# Altium schematic sheet HX6320.SchDoc.schdoc
size A3
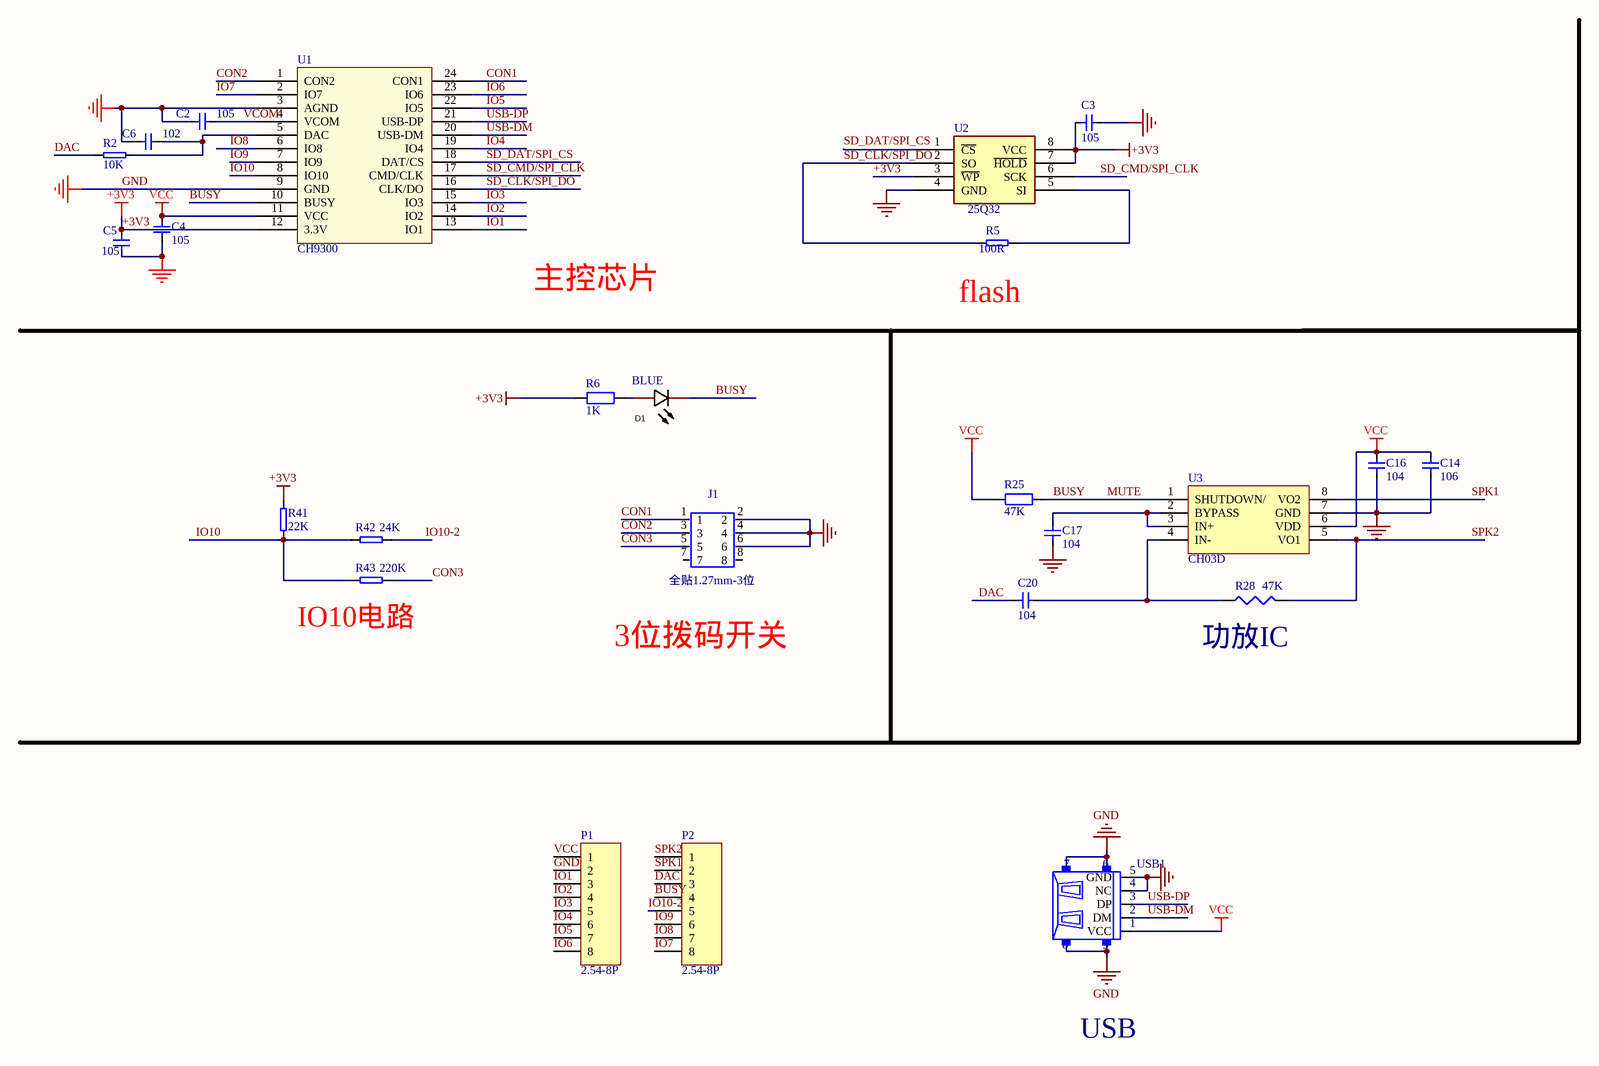
[diagram p0: HX6320.SchDoc.schdoc]

## Parts
C2  105  [C0603]
C3  105  [C0603]
C4  105  [C0603]
C5  105  [C0603]
C6  102  [C0603]
C14  106  [C0603]
C16  104  [C0603]
C17  104  [C0603]
C20  104  [C0603]
D1  BLUE  [LC-0603_LED_S1]
J1  全贴1.27mm-3位  [SW-SMD_DSHP02TSGER]
P1  2.54-8P  [HDR1X8]
P2  2.54-8P  [HDR1X8]
R2  10K  [R0603]
R5  100R  [R0603]
R6  1K  [R0603]
R25  47K  [R0603]
R28  47K  [R0603]
R41  22K  [R0603]
R42  24K  [R0603]
R43  220K  [R0603]
U1  CH9300  [QSOP24]
U2  25Q32  [LC-SOIC-8_150-208mil]
U3  CH03D  [LC-SOP-8_150mil]
USB1  USB-5PIN  [USB-MIRO]  (value not drawn)

## Nets
+3V3: C3.1 C5.1 R6.1 R41.2 U1.12(3.3V) U2.3(~{WP}) U2.7(~{HOLD}) U2.8(VCC)
GND: C2.2 C3.2 C4.1 C5.2 C6.2 C14.1 C16.1 C17.1 J1.2 J1.4 J1.6 P1.2 U1.3(AGND) U1.9(GND) U2.4(GND) U3.7(GND) USB1.4(NC) USB1.5(GND) USB1.6 USB1.7 USB1.8 USB1.9
VCC: C4.2 C14.2 C16.2 P1.1 R25.2 U1.11(VCC) U3.6(VDD) USB1.1(VCC)
BUSY: D1.1(K) P2.4 R25.1 U1.10(BUSY) U3.1(SHUTDOWN/)  [also labelled MUTE]
CON1: J1.1 U1.24(CON1)
CON2: J1.3 U1.1(CON2)
CON3: J1.5 R43.1
DAC: C20.1 P2.3 R2.2
IO1: P1.3 U1.13(IO1)
IO2: P1.4 U1.14(IO2)
IO3: P1.5 U1.15(IO3)
IO4: P1.6 U1.19(IO4)
IO5: P1.7 U1.22(IO5)
IO6: P1.8 U1.23(IO6)
IO7: P2.8 U1.2(IO7)
IO8: P2.7 U1.6(IO8)
IO9: P2.6 U1.7(IO9)
IO10: R41.1 R42.2 R43.2 U1.8(IO10)
IO10-2: P2.5 R42.1
SD_CLK/SPI_DO: R5.2 U1.16(CLK/DO) U2.2(SO)
SD_CMD/SPI_CLK: U1.17(CMD/CLK) U2.6(SCK)
SD_DAT/SPI_CS: U1.18(DAT/CS) U2.1(~{CS})
SPK1: P2.2 U3.8(VO2)
SPK2: P2.1 R28.2 U3.5(VO1)
USB-DM: U1.20(USB-DM) USB1.2(DM)
USB-DP: U1.21(USB-DP) USB1.3(DP)
VCOM: C2.1 U1.4(VCOM)
NetC6_1: C6.1 R2.1 U1.5(DAC)
NetC17_2: C17.2 U3.2(BYPASS) U3.3(IN+)
NetC20_2: C20.2 R28.1 U3.4(IN-)
NetD1_2: D1.2(A) R6.2
NetR5_1: R5.1 U2.5(SI)

Not connected (* = marked no-connect by the designer): J1 7 8

## Notes on the sheet
- 主控芯片
- (near R5) flash
- (near R43) IO10电路
- 3位拨码开关
- (near R28) 功放IC
- USB

## Library data of the parts
C2-C6 C14 C16 C17 C20 = CAP: Capacitor
D1 = NCD0603R1_C84263: Manufacturer: 国星光电; Symbol: FC-DA1608HRK-620D; Add into BOM: yes; Emitted Color: 红灯; Name: NCD0603R1; Device: NCD0603R1_C84263; LCSC Part Name: 红灯; Supplier Part: C84263; Manufacturer Part: NCD0603R1; Supplier Footprint: 0603; JLCPCB Part Class: Extended Part; Datasheet: https://atta.szlcsc.com/upload/public/pdf/source/20200820/C84263_DABC6A75E58F576973B407FDBA283D60.pdf; Supplier: LCSC; Convert to PCB: yes
J1 = CON_A: PCB DECAL: CON4_A
P1 P2 = Header 8: Header, 8-Pin; LatestRevisionDate: 17-Jul-2002; LatestRevisionNote: Re-released for DXP Platform.; Publisher: Altium Limited
R2 R5 R41-R43 = RES
R6 R25 = R: 贴片电阻; 版权归属: 源创客; BOM名称: 贴片电阻; 学习资源: www.ooocke.com
R28 = Res3: 0805.PcbLib; Published: 8-Jun-2000; LatestRevisionDate: 17-Jul-2002; LatestRevisionNote: Re-released for DXP Platform.; Publisher: Altium Limited
U1 = COMPONENT_2
U2 = A25Q32
U3 = LM4890